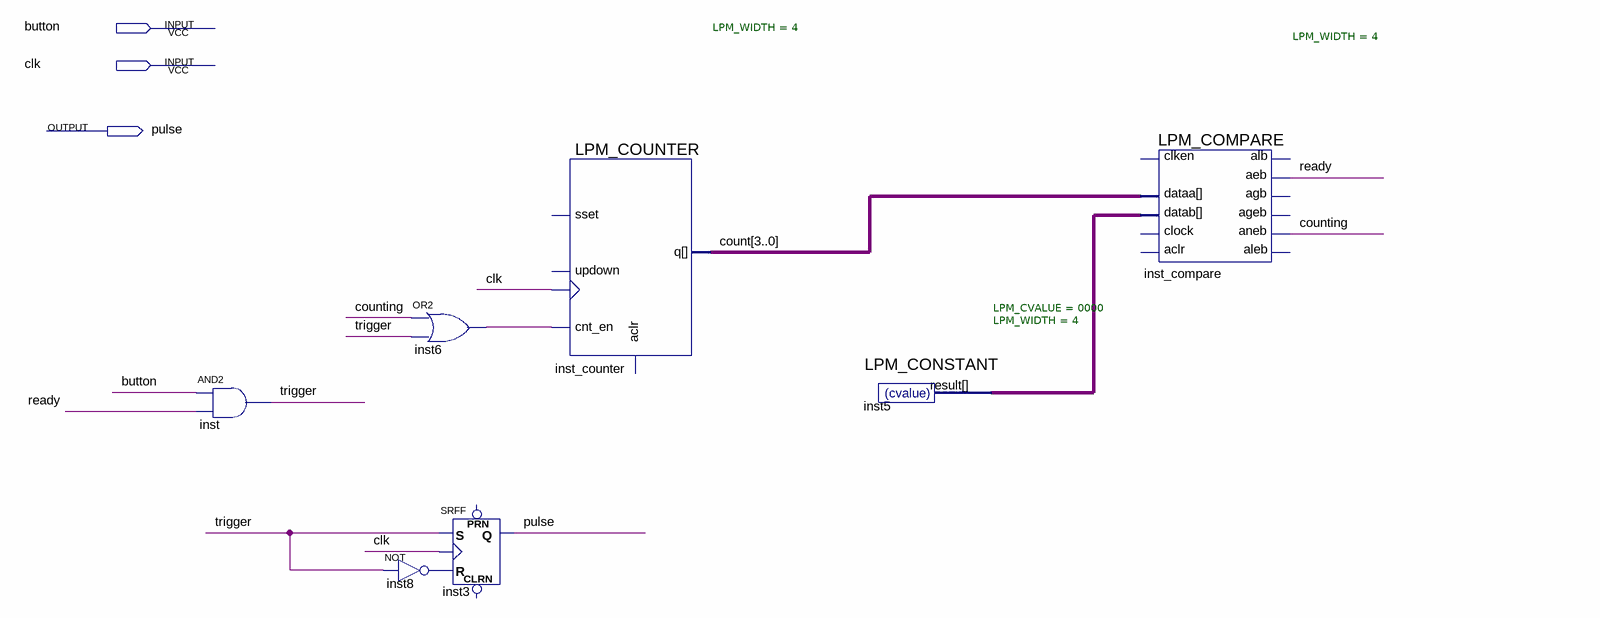
[diagram p0: schematic sheet]
// Quartus schematic g58_pulse_gen.bdf as structural Verilog: 7 symbols, 3 pins
module g58_pulse_gen (
  input  button,
  input  clk,
  output pulse
);

  wire counting, inst6_out, inst8_out, ready, trigger;
  wire [3:0] count, inst5_result;

  and inst (trigger, button, ready);
  not inst8 (inst8_out, trigger);
  or inst6 (inst6_out, counting, trigger);
  SRFF inst3 (.S(trigger), .R(inst8_out), .CLK(clk), .Q(pulse));  // open: PRN, CLRN
  LPM_COUNTER #(.LPM_WIDTH(4)) inst_counter (.clock(clk), .cnt_en(inst6_out), .q(count));  // open: aclr, sset, updown
  LPM_CONSTANT #(.LPM_CVALUE(0000), .LPM_WIDTH(4)) inst5 (.result(inst5_result));
  LPM_COMPARE #(.LPM_WIDTH(4)) inst_compare (
    .dataa(count), .datab(inst5_result), .aeb(ready), .aneb(counting));  // open: clock, aclr, clken, aleb, agb, ageb, alb
endmodule
